# EAGLE design MD4 (EAGLE 7.4.0)
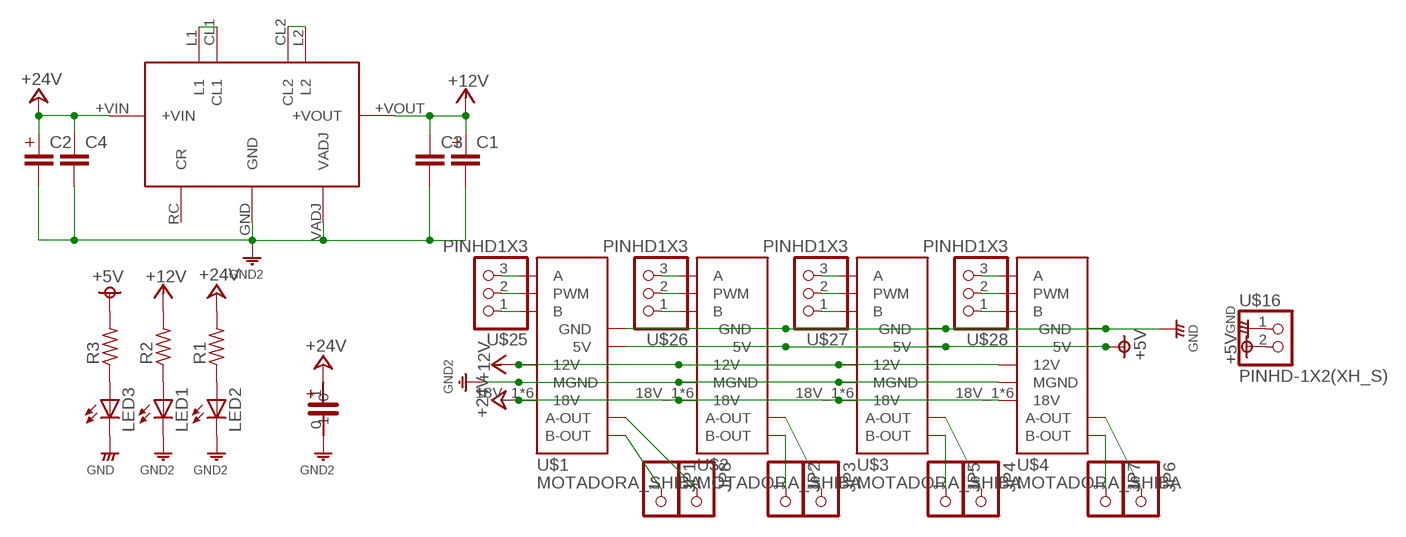
[diagram p0: schematic, sheet 1]

## Parts
C1  CAPACITOR-1U  [C_1U]
C2  CAPACITOR-1U  [C_1U]
C3  MLCC-5  [MLCC_50]
C4  MLCC-5  [MLCC_50]
CAPACITOR1  CAPACITOR  [CAPACITOR]
JP1  PINHD-1X1  [1X01]
JP2  PINHD-1X1  [1X01]
JP3  PINHD-1X1  [1X01]
JP4  PINHD-1X1  [1X01]
JP5  PINHD-1X1  [1X01]
JP6  PINHD-1X1  [1X01]
JP7  PINHD-1X1  [1X01]
JP8  PINHD-1X1  [1X01]
LED1  LED3MM  [LED3MM]
LED2  LED3MM  [LED3MM]
LED3  LED3MM  [LED3MM]
R1  RESISTORS-3  [R_0.3]
R2  RESISTORS-3  [R_0.3]
R3  RESISTORS-3  [R_0.3]
U$1  MOTADORA_SHIBA  [MOTADORA_SHIBA]
U$2  MOTADORA_SHIBA  [MOTADORA_SHIBA]
U$3  MOTADORA_SHIBA  [MOTADORA_SHIBA]
U$4  MOTADORA_SHIBA  [MOTADORA_SHIBA]
U$10  HPH12002M  [HPH12002M]
U$16  PINHD-1X2(XH_S)  [1X2(XH-S)]
U$25  PINHD1X3  [1X3(XH)]
U$26  PINHD1X3  [1X3(XH)]
U$27  PINHD1X3  [1X3(XH)]
U$28  PINHD1X3  [1X3(XH)]

## Nets
+5V: R3.2 U$1.5V U$1.5V_2(5V) U$2.5V U$2.5V_2(5V) U$3.5V U$3.5V_2(5V) U$4.5V U$4.5V_2(5V) U$16.2
+12V: C1.P$1 C3.1 R2.2 U$1.12V_1(12V) U$1.12V_2(12V) U$1.12V_3(12V) U$1.12V_4(12V) U$1.12V_5(12V) U$1.12V_6(12V) U$2.12V_1(12V) U$2.12V_2(12V) U$2.12V_3(12V) U$2.12V_4(12V) U$2.12V_5(12V) U$2.12V_6(12V) U$3.12V_1(12V) U$3.12V_2(12V) U$3.12V_3(12V) U$3.12V_4(12V) U$3.12V_5(12V) U$3.12V_6(12V) U$4.12V_1(12V) U$4.12V_2(12V) U$4.12V_3(12V) U$4.12V_4(12V) U$4.12V_5(12V) U$4.12V_6(12V) U$10.+VOUT
GND: LED3.K(C) U$1.GND U$1.GND2(GND) U$2.GND U$2.GND2(GND) U$3.GND U$3.GND2(GND) U$4.GND U$4.GND2(GND) U$16.1
GND12: C1.P$2 C2.P$2 C3.2 C4.2 CAPACITOR1.0 LED1.K(C) LED2.K(C) U$1.MGND_1(MGND) U$1.MGND_2(MGND) U$1.MGND_3(MGND) U$1.MGND_4(MGND) U$1.MGND_5(MGND) U$1.MGND_6(MGND) U$2.MGND_1(MGND) U$2.MGND_2(MGND) U$2.MGND_3(MGND) U$2.MGND_4(MGND) U$2.MGND_5(MGND) U$2.MGND_6(MGND) U$3.MGND_1(MGND) U$3.MGND_2(MGND) U$3.MGND_3(MGND) U$3.MGND_4(MGND) U$3.MGND_5(MGND) U$3.MGND_6(MGND) U$4.MGND_1(MGND) U$4.MGND_2(MGND) U$4.MGND_3(MGND) U$4.MGND_4(MGND) U$4.MGND_5(MGND) U$4.MGND_6(MGND) U$10.GND U$10.VADJ ; supply symbol labelled GND2
N$1: JP1.1 U$1.B-OUT_1(B-OUT) U$1.B-OUT_2(B-OUT) U$1.B-OUT_3(B-OUT) U$1.B-OUT_4(B-OUT) U$1.B-OUT_5(B-OUT) U$1.B-OUT_6(B-OUT)
N$3: JP3.1 U$2.A-OUT_1(A-OUT) U$2.A-OUT_2(A-OUT) U$2.A-OUT_3(A-OUT) U$2.A-OUT_4(A-OUT) U$2.A-OUT_5(A-OUT) U$2.A-OUT_6(A-OUT)
N$4: JP4.1 U$3.A-OUT_1(A-OUT) U$3.A-OUT_2(A-OUT) U$3.A-OUT_3(A-OUT) U$3.A-OUT_4(A-OUT) U$3.A-OUT_5(A-OUT) U$3.A-OUT_6(A-OUT)
N$5: JP5.1 U$3.B-OUT_1(B-OUT) U$3.B-OUT_2(B-OUT) U$3.B-OUT_3(B-OUT) U$3.B-OUT_4(B-OUT) U$3.B-OUT_5(B-OUT) U$3.B-OUT_6(B-OUT)
N$7: JP7.1 U$4.B-OUT_1(B-OUT) U$4.B-OUT_2(B-OUT) U$4.B-OUT_3(B-OUT) U$4.B-OUT_4(B-OUT) U$4.B-OUT_5(B-OUT) U$4.B-OUT_6(B-OUT)
N$8: JP8.1 U$1.A-OUT_1(A-OUT) U$1.A-OUT_2(A-OUT) U$1.A-OUT_3(A-OUT) U$1.A-OUT_4(A-OUT) U$1.A-OUT_5(A-OUT) U$1.A-OUT_6(A-OUT)
N$9: U$1.B U$1.B2(B) U$25.1
N$10: U$1.PWM U$1.PWM2(PWM) U$25.2
N$11: U$1.A U$1.A2(A) U$25.3
N$12: U$2.B U$2.B2(B) U$26.1
N$13: U$2.PWM U$2.PWM2(PWM) U$26.2
N$14: U$2.A U$2.A2(A) U$26.3
N$15: U$3.B U$3.B2(B) U$27.1
N$16: U$3.PWM U$3.PWM2(PWM) U$27.2
N$17: U$3.A U$3.A2(A) U$27.3
N$18: U$4.B U$4.B2(B) U$28.1
N$19: U$4.PWM U$4.PWM2(PWM) U$28.2
N$20: U$4.A U$4.A2(A) U$28.3
N$21: LED2.A R1.1
N$22: U$10.CL2 U$10.L2
N$23: U$10.CL1 U$10.L1
N$24: LED1.A R2.1
N$25: LED3.A R3.1
N$26: JP6.1 U$4.A-OUT_1(A-OUT) U$4.A-OUT_2(A-OUT) U$4.A-OUT_3(A-OUT) U$4.A-OUT_4(A-OUT) U$4.A-OUT_5(A-OUT) U$4.A-OUT_6(A-OUT)
N$27: JP2.1 U$2.B-OUT_1(B-OUT) U$2.B-OUT_2(B-OUT) U$2.B-OUT_3(B-OUT) U$2.B-OUT_4(B-OUT) U$2.B-OUT_5(B-OUT) U$2.B-OUT_6(B-OUT)
N$30: C2.P$1 C4.1 CAPACITOR1.1 R1.2 U$1.18V_1(18V) U$1.18V_2(18V) U$1.18V_3(18V) U$1.18V_4(18V) U$1.18V_5(18V) U$1.18V_6(18V) U$2.18V_1(18V) U$2.18V_2(18V) U$2.18V_3(18V) U$2.18V_4(18V) U$2.18V_5(18V) U$2.18V_6(18V) U$3.18V_1(18V) U$3.18V_2(18V) U$3.18V_3(18V) U$3.18V_4(18V) U$3.18V_5(18V) U$3.18V_6(18V) U$4.18V_1(18V) U$4.18V_2(18V) U$4.18V_3(18V) U$4.18V_4(18V) U$4.18V_5(18V) U$4.18V_6(18V) U$10.+VIN ; supply symbol labelled +24V
Unconnected: U$10.RC(CR)

## Library data of the parts
C1 C2 = rcl__s:CAPACITOR
C3 C4 = rcl__s:MLCC: CAPACITOR, European symbol
CAPACITOR1 = capacitor 3300:CAPACITOR: capacitor3300
JP1-JP8 = pinhead_s:PINHD-1X1: PIN HEADER
LED1-LED3 = LED_s:LED: LED OSRAM: - CHIPLED LG R971, LG N971, LY N971, LG Q971, LY Q971, LO R971, LY R971 LH N974, LH R974 LS Q976, LO Q976, LY Q976 LO Q996 - Hyper CHIPLED LW Q18S LB Q993, LB Q99A, LB R99A - SideLED LS A670, LO A670, LY A670, LG A670, LP A670 LB A673, LV A673, LT A673, LW A673 LH A674 LY A675 LS A676, LA A676, LO A676, LY A676, LW A676 LS A679, LY A679, LG A679 - Hyper Micro SIDELED® LS Y876, LA Y876, LO Y876, LY Y876 LT Y87S - SmartLED LW L88C, LW L88S LB L89C, LB L89S, LG L890 LS L89K, LO L89K, LY L89K LS L896, LA L896, LO L896, LY L896 - TOPLED LS T670, LO T670, LY T670, LG T670, LP T670 LSG T670, LSP T670, LSY T670, LOP T670, LYG T670 LG T671, LOG T671, LSG T671 LB T673, LV T673, LT T673, LW T673 LH T674 LS T676, LA T676, LO T676, LY T676, LB T676, LH T676, LSB T676, LW T676 LB T67C, LV T67C, LT T67C, LS T67K, LO T67K, LY T67K, LW E67C LS E67B, LA E67B, LO E67B, LY E67B, LB E67C, LV E67C, LT E67C LW T67C LS T679, LY T679, LG T679 LS T770, LO T770, LY T770, LG T770, LP T770 LB T773, LV T773, LT T773, LW T773 LH T774 LS E675, LA E675, LY E675, LS T675 LS T776, LA T776, LO T776, LY T776, LB T776 LHGB T686 LT T68C, LB T68C - Hyper Mini TOPLED® LB M676 - Mini TOPLED Santana® LG M470 LS M47K, LO M47K, LY M47K Source: http://www.osram.convergy.de - LUMILED® LXK2-PW12-R00, LXK2-PW12-S00, LXK2-PW14-U00, LXK2-PW14-V00 LXK2-PM12-R00, LXK2-PM12-S00, LXK2-PM14-U00 LXK2-PE12-Q00, LXK2-PE12-R00, LXK2-PE12-S00, LXK2-PE14-T00, LXK2-PE14-U00 LXK2-PB12-K00, LXK2-PB12-L00, LXK2-PB12-M00, LXK2-PB14-N00, LXK2-PB14-P00, LXK2-PB14-Q00 LXK2-PR12-L00, LXK2-PR12-M00, LXK2-PR14-Q00, LXK2-PR14-R00 LXK2-PD12-Q00, LXK2-PD12-R00, LXK2-PD12-S00 LXK2-PH12-R00, LXK2-PH12-S00 LXK2-PL12-P00, LXK2-PL12-Q00, LXK2-PL12-R00 Source: www.luxeon.com
R1-R3 = rcl__s:RESISTORS
U$1-U$4 = motadora2011:MOTADORA_SHIBA
U$10 = dc-dc_s:HPH12002M: ＤＣ－ＤＣコンバータ ５～２４Ｖ可変 http://akizukidenshi.com/catalog/g/gM-02038/
U$16 = pinhead_s:PINHD-1X2(XH_S)
U$25-U$28 = pinhead_s:PINHD1X3

## Board
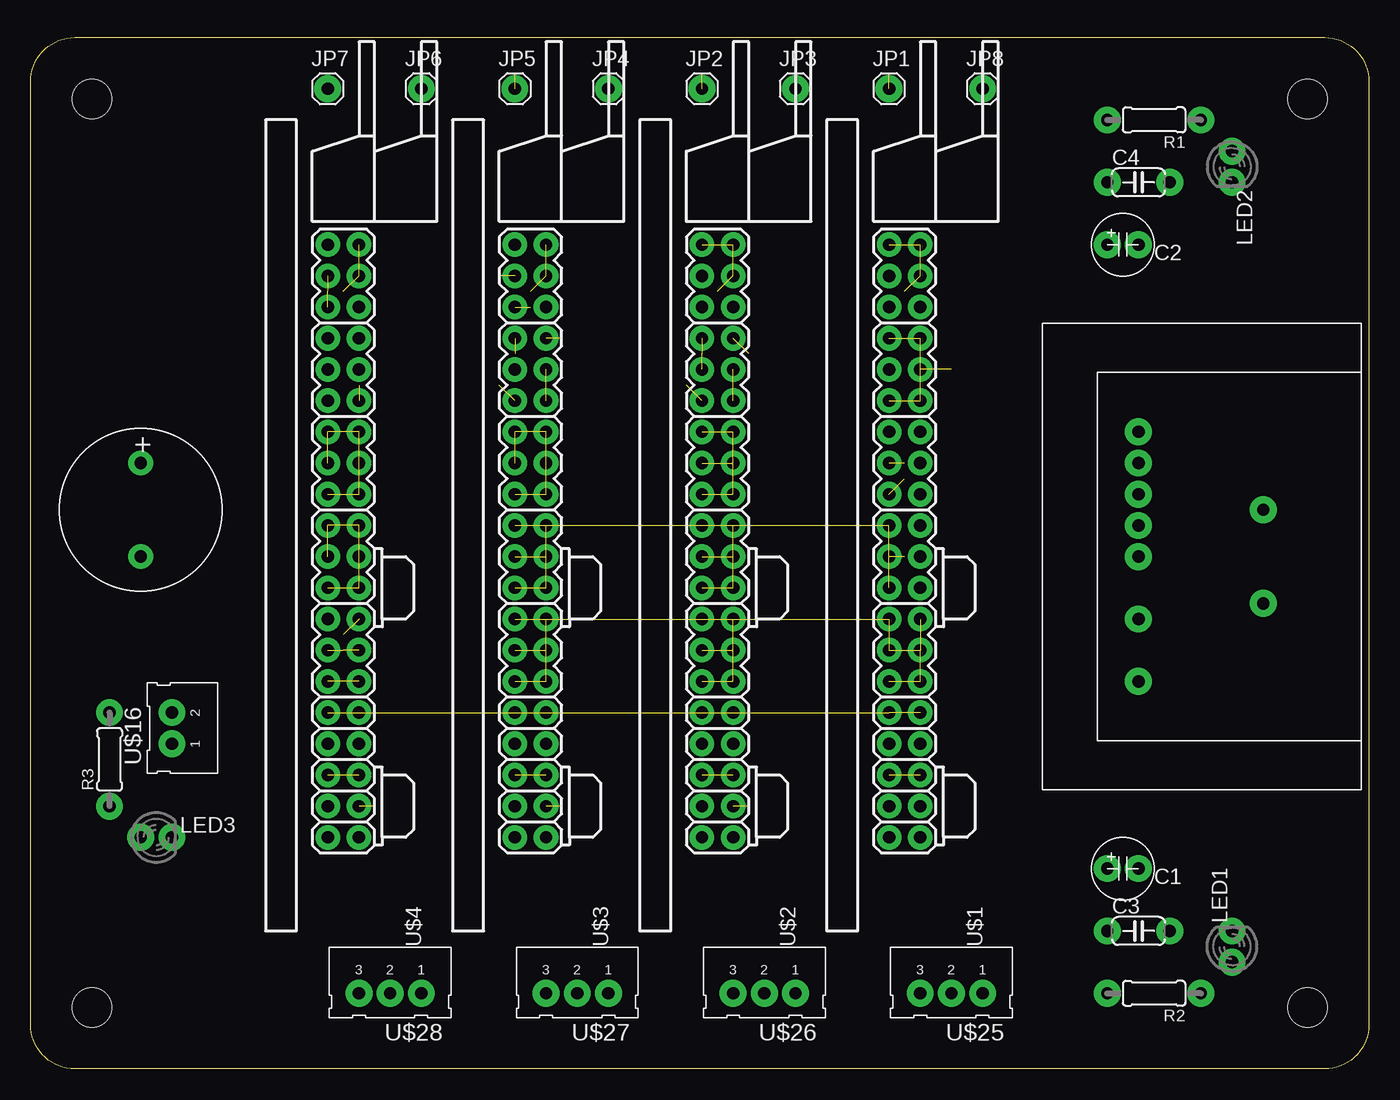
[diagram p1: board, top side]
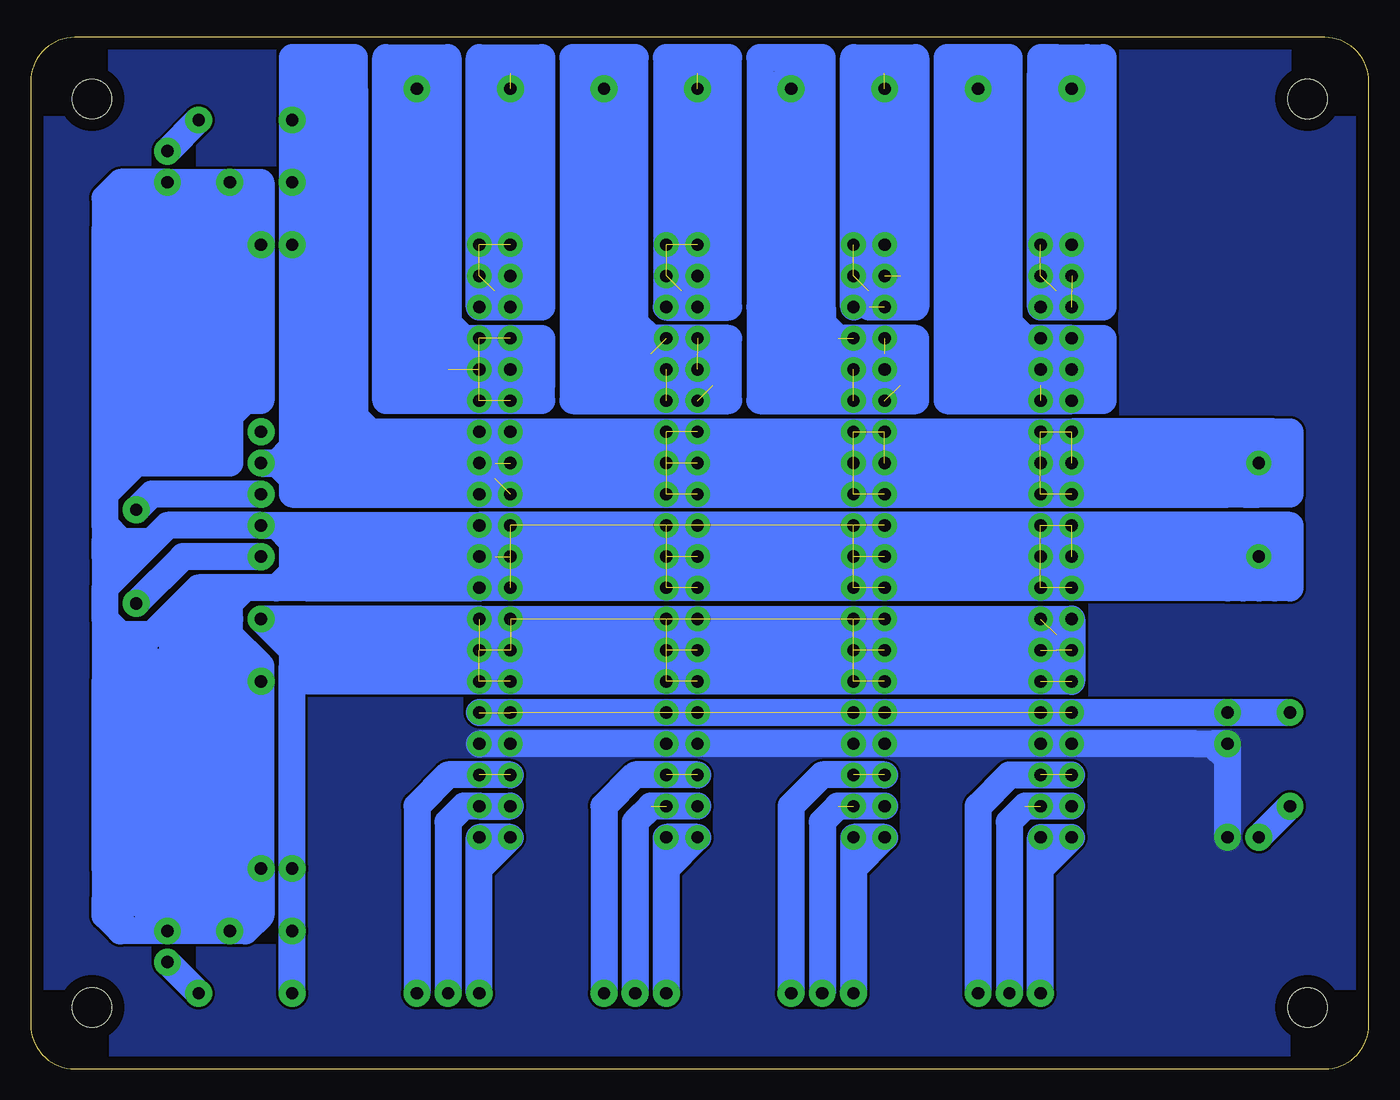
[diagram p2: board, bottom side, seen from below]

Size 109 x 84 mm. Coordinates in mm from the lower left corner, seen from the top.
Outline: 105.39,0 3.61,0 arc-90 0,3.61 0,80.39 arc-90 3.61,84 105.39,84 arc-90 109,80.39 109,3.61 arc-90 105.39,0
Copper layers (1*16): Top 0.035mm / dielectric 1.5mm / Bottom 0.035mm
Design rules "default": minimum track width 10mil, minimum drill 24mil, track to track 8mil, track to pad 8mil, pad to pad 8mil, via to via 8mil, smd to smd 8mil, copper to edge 40mil, drill to drill 8mil, minimum pad ring 10mil, minimum via ring 8mil, stop-mask expansion 4mil, vias tented up to drill 0mil, thermal gap 10mil
Holes 3.2 mm at 5,5 104,5 104,79 5,79

### Footprints (pad centres in the part's own frame; a part is rotated, then mirrored left to right if it is on the bottom)
C_1U = drill 1 pad 2.184: P$1 -1.27,0; P$2 1.27,0
MLCC_50 = drill 1 pad 2.184: 1 -2.54,0; 2 2.54,0
CAPACITOR = drill 1 pad 2: 0 -3.81,0; 1 3.81,0
1X01 = drill 1 pad 2.184: 1 0,0
LED3MM = drill 1 pad 2.184: A -1.27,0; K 1.27,0
R_0.3 = drill 1 pad 2.184: 1 -3.81,0; 2 3.81,0
MOTADORA_SHIBA = drill 1 pad 2: 5V -12.7,-1.27; 5V_2 -12.7,1.27; 12V_1 -10.16,-1.27; 12V_2 -7.62,-1.27; 12V_3 -5.08,-1.27; 12V_4 -10.16,1.27; 12V_5 -7.62,1.27; 12V_6 -5.08,1.27; 18V_1 5.08,-1.27; 18V_2 7.62,-1.27; 18V_3 10.16,-1.27; 18V_4 5.08,1.27; 18V_5 7.62,1.27; 18V_6 10.16,1.27; A -22.86,-1.27; A2 -22.86,1.27; A-OUT_1 12.7,-1.27; A-OUT_2 15.24,-1.27; A-OUT_3 17.78,-1.27; A-OUT_4 12.7,1.27; A-OUT_5 15.24,1.27; A-OUT_6 17.78,1.27; B -17.78,-1.27; B2 -17.78,1.27; B-OUT_1 20.32,-1.27; B-OUT_2 22.86,-1.27; B-OUT_3 25.4,-1.27; B-OUT_4 20.32,1.27; B-OUT_5 22.86,1.27; B-OUT_6 25.4,1.27; GND -15.24,-1.27; GND2 -15.24,1.27; MGND_1 -2.54,-1.27; MGND_2 0,-1.27; MGND_3 2.54,-1.27; MGND_4 -2.54,1.27; MGND_5 0,1.27; MGND_6 2.54,1.27; PWM -20.32,-1.27; PWM2 -20.32,1.27
HPH12002M = drill 1 pad 2.184: +VIN -7.62,-10.16; +VOUT 5.08,-10.16; CL1 0,-10.16; CL2 -5.08,-10.16; GND -2.54,-10.16; L1 3.81,0; L2 -3.81,0; RC -10.16,-10.16; VADJ 10.16,-10.16
1X2(XH-S) = drill 1 pad 2.184: 1 -6.35,0; 2 -3.81,0
1X3(XH) = drill 1 pad 2.184: 1 -2.54,0; 2 0,0; 3 2.54,0

### Placement (x,y rotation side)
C1  88.97,16.32 0 top
C2  88.97,67.12 0 top
C3  90.24,11.24 0 top
C4  90.24,72.2 0 top
CAPACITOR1  8.96,45.53 90 top
JP1  69.92,79.82 0 top
JP2  54.68,79.82 0 top
JP3  62.3,79.82 0 top
JP4  47.06,79.82 0 top
JP5  39.44,79.82 0 top
JP6  31.82,79.82 0 top
JP7  24.2,79.82 0 top
JP8  77.54,79.82 0 top
LED1  97.86,9.97 90 top
LED2  97.86,73.47 270 top
LED3  10.23,18.86 0 top
R1  91.51,77.28 180 top
R2  91.51,6.16 180 top
R3  6.42,25.21 90 top
U$1  71.19,41.72 90 top
U$2  55.95,41.72 90 top
U$3  40.71,41.72 90 top
U$4  25.47,41.72 90 top
U$10  100.4,41.72 270 top
U$16  11.5,32.83 90 top
U$25  75,6.16 180 top
U$26  59.76,6.16 180 top
U$27  44.52,6.16 180 top
U$28  29.28,6.16 180 top

### Tracks (layer width: path | path; a pad name or v marks a point on that pad's centre or on a via)
+5V  (7 unrouted)
  Bottom 2.184: U$1.5V U$16.2 R3.2
+12V  (21 unrouted)
  Bottom 2.184: R2.2 C3.1 C1.P$1 87.7,31.56 | 87.7,31.56 87.7,32.83 | 87.7,34.1 U$10.+VOUT 87.7,36.64 | 87.7,36.64 U$1.12V_3 U$4.12V_6 24.2,32.83 | 24.2,32.83 U$4.12V_4 87.7,31.56 | 87.7,36.64 87.7,35.37 | 87.7,35.37 87.7,34.1 | 87.7,35.37 25.47,35.37 25.47,34.1 87.7,34.1 | 87.7,34.1 87.7,32.83 | 87.7,32.83 24.2,32.83
GND
  Bottom 2.184: 12.77,26.48 U$16.1 11.5,25.21 | U$1.GND 14.04,26.48 12.77,26.48 | LED3.K 11.5,25.21 | 12.77,26.48 11.5,25.21
  pour Bottom: -1.2,84.9 110.56,84.9 110.56,1.08 -1.2,1.08
GND12  (20 unrouted)
  Bottom 2.184: CAPACITOR1.0 U$4.MGND_6 | U$4.MGND_6 U$1.MGND_3 | CAPACITOR1.0 11.5,39.18 | 11.5,39.18 U$1.MGND_1 | U$1.MGND_1 72.46,40.45 | 72.46,40.45 U$1.MGND_2 | 72.46,42.99 U$1.MGND_3 | CAPACITOR1.0 8.96,40.45 10.23,39.18 | 10.23,39.18 11.5,39.18 | CAPACITOR1.0 10.23,42.99 72.46,42.99 | 72.46,42.99 71.19,41.72 10.23,41.72 11.5,40.45 72.46,40.45 | U$10.GND U$1.MGND_3 | 90.24,13.78 C1.P$2 U$10.VADJ 90.24,32.83 92.78,35.37 92.78,36.64 | 90.24,13.78 C3.2 | C3.2 LED1.K | LED2.K C4.2 90.24,72.2 C2.P$2 | U$10.GND 97.86,44.26 99.13,42.99 | 100.4,41.72 101.67,41.72 | 101.67,41.72 102.94,41.72 | 102.94,41.72 102.94,42.99 | 102.94,44.26 102.94,46.8 | 102.94,48.07 102.94,67.12 | 102.94,67.12 LED2.K | 102.94,41.72 102.94,39.18 | 102.94,36.64 102.94,31.56 | 102.94,16.32 LED1.K | U$10.GND 88.97,44.26 87.7,42.99 87.7,40.45 | 87.7,40.45 86.43,39.18 | 86.43,39.18 U$1.MGND_1 | 72.46,40.45 85.16,40.45 86.43,41.72 86.43,42.99 72.46,42.99 | 72.46,42.99 U$1.MGND_2 | U$1.MGND_2 85.16,41.72 | C2.P$2 92.78,67.12 | 92.78,67.12 100.4,67.12 | 102.94,67.12 100.4,67.12 | 100.4,67.12 96.59,70.93 91.51,70.93 91.51,68.39 97.86,68.39 96.59,69.66 92.78,69.66 | LED2.K 101.67,72.2 102.94,70.93 102.94,68.39 | 102.94,67.12 102.94,68.39 | 102.94,68.39 100.4,70.93 | 86.43,39.18 88.97,39.18 | 88.97,39.18 91.51,39.18 | 91.51,39.18 92.78,39.18 | 92.78,39.18 95.32,39.18 99.13,35.37 | 102.94,31.56 99.13,35.37 | 99.13,35.37 101.67,35.37 102.94,36.64 | 102.94,36.64 102.94,39.18 | 102.94,39.18 100.4,41.72 | 99.13,42.99 100.4,41.72 | 100.4,41.72 101.67,42.99 | 101.67,42.99 102.94,44.26 | 102.94,44.26 102.94,42.99 | 102.94,42.99 101.67,41.72 | 101.67,41.72 101.67,42.99 | 101.67,42.99 99.13,42.99
  Bottom 2.184: 92.78,36.64 92.78,37.91 | 92.78,37.91 91.51,39.18 | C2.P$2 90.24,54.42 91.51,54.42 92.78,53.15 92.78,49.34 100.4,49.34 102.94,46.8 | 102.94,46.8 102.94,48.07 | 102.94,48.07 100.4,50.61 94.05,50.61 94.05,65.85 92.78,67.12 | 92.78,67.12 91.51,65.85 91.51,55.69 95.32,51.88 101.67,51.88 | 101.67,51.88 101.67,50.61 | 101.67,51.88 101.67,65.85 92.78,65.85 92.78,55.69 95.32,53.15 100.4,53.15 100.4,64.58 95.32,64.58 95.32,54.42 99.13,54.42 99.13,63.31 97.86,63.31 | 97.86,63.31 96.59,63.31 96.59,55.69 97.86,55.69 97.86,63.31 | 102.94,16.32 102.94,31.56 | 92.78,39.18 92.78,37.91 | 92.78,36.64 95.32,36.64 94.05,37.91 95.32,37.91 | LED1.K 101.67,11.24 102.94,12.51 102.94,13.78 | 102.94,16.32 102.94,13.78 | 102.94,13.78 101.67,12.51 | 90.24,13.78 90.24,12.51 91.51,11.24 C3.2 | 87.7,40.45 88.97,39.18 | CAPACITOR1.0 6.42,44.26 | 6.42,44.26 6.42,39.18 7.69,39.18 | 7.69,39.18 8.96,39.18 | 8.96,39.18 7.69,40.45 | 7.69,40.45 7.69,42.99 | 7.69,40.45 7.69,39.18 | 8.96,39.18 10.23,39.18 | 6.42,44.26 8.96,44.26 | 8.96,44.26 U$4.MGND_6 | 8.96,44.26 CAPACITOR1.0
N$1  (4 unrouted)
  Bottom 2.184: JP1.1 U$1.B-OUT_5 | U$1.B-OUT_1 72.46,82.36 67.38,82.36 67.38,62.04 U$1.B-OUT_4 | U$1.B-OUT_4 U$1.B-OUT_1 | U$1.B-OUT_1 71.19,63.31 | 71.19,79.82 71.19,81.09 69.92,81.09 | 69.92,81.09 68.65,81.09 68.65,63.31 71.19,63.31 | 71.19,63.31 71.19,79.82 | 71.19,79.82 69.92,81.09 | 69.92,81.09 U$1.B-OUT_4
N$2
  Bottom 6.452: 100.4,31.56 100.4,18.86 95.32,13.78 92.78,16.32 92.78,31.56 95.32,34.1 95.32,18.86
N$3  (5 unrouted)
  Bottom 2.184: JP3.1 62.3,62.04 58.49,58.23 | 58.49,58.23 U$2.A-OUT_2 | 54.68,58.23 58.49,58.23 | 58.49,58.23 61.03,58.23 61.03,81.09 63.57,81.09 63.57,55.69 53.41,55.69 53.41,56.96 62.3,56.96 62.3,60.77
N$4  (4 unrouted)
  Bottom 2.184: JP4.1 47.06,62.04 45.79,60.77 | 45.79,60.77 44.52,59.5 | 44.52,59.5 U$3.A-OUT_2 | 36.9,59.5 38.17,59.5 | 38.17,59.5 43.25,59.5 | 43.25,59.5 44.52,59.5 | 44.52,59.5 44.52,60.77 | 49.6,62.04 49.6,82.36 44.52,82.36 44.52,62.04 44.52,60.77 | 49.6,62.04 49.6,54.42 36.9,54.42 36.9,59.5 | 36.9,59.5 U$3.A-OUT_5 | 38.17,59.5 38.17,55.69 48.33,55.69 48.33,60.77 44.52,56.96 U$3.A-OUT_5 | U$3.A-OUT_5 39.44,58.23 45.79,58.23 47.06,56.96 | 49.6,62.04 48.33,62.04 48.33,79.82 47.06,81.09 45.79,81.09 45.79,60.77 | 44.52,60.77 43.25,59.5
N$5  (5 unrouted)
  Bottom 2.184: JP5.1 U$3.B-OUT_6 | 40.71,62.04 36.9,62.04 36.9,82.36 41.98,82.36 U$3.B-OUT_1 40.71,63.31 40.71,81.09 39.44,81.09 | 39.44,81.09 38.17,81.09 38.17,64.58 39.44,63.31 | 38.17,63.31 39.44,63.31 | 39.44,63.31 39.44,81.09
N$7  (4 unrouted)
  Bottom 2.184: JP7.1 U$4.B-OUT_6 24.2,63.31 22.93,63.31 22.93,79.82 24.2,81.09 25.47,79.82 25.47,63.31 U$4.B-OUT_1 | U$4.B-OUT_1 26.74,81.09 | 26.74,81.09 25.47,82.36 | 25.47,82.36 22.93,82.36 | 22.93,82.36 21.66,81.09 | 21.66,81.09 21.66,79.82 21.66,62.04 U$4.B-OUT_1 | 25.47,82.36 26.74,82.36 26.74,81.09 | 22.93,82.36 21.66,82.36 21.66,81.09
N$8  (5 unrouted)
  Bottom 2.184: JP8.1 77.54,59.5 75,56.96 U$1.A-OUT_5
N$9  (1 unrouted)
  Bottom 2.184: U$1.B2 75,23.94 77.54,21.4 U$25.1
N$10
  Bottom 2.184: U$1.PWM2 U$1.PWM 73.73,21.4 75,20.13 U$25.2
N$11
  Bottom 2.184: U$25.3 72.46,16.32 | 72.46,16.32 U$1.A U$1.A2 72.46,16.32
N$12  (1 unrouted)
  Bottom 2.184: U$2.B2 59.76,23.94 62.3,21.4 U$26.1
N$13  (1 unrouted)
  Bottom 2.184: U$2.PWM2 58.49,21.4 59.76,20.13 U$26.2
N$14
  Bottom 2.184: U$26.3 57.22,16.32 | 57.22,16.32 U$2.A U$2.A2 57.22,16.32
N$15  (1 unrouted)
  Bottom 2.184: U$3.B2 44.52,23.94 47.06,21.4 U$27.1
N$16  (1 unrouted)
  Bottom 2.184: U$3.PWM2 43.25,21.4 44.52,20.13 U$27.2
N$17
  Bottom 2.184: 41.98,16.32 U$3.A U$3.A2 41.98,16.32 | 41.98,16.32 U$27.3
N$18  (1 unrouted)
  Bottom 2.184: U$4.B2 29.28,23.94 31.82,21.4 U$28.1
N$19  (1 unrouted)
  Bottom 2.184: U$4.PWM2 28.01,21.4 29.28,20.13 U$28.2
N$20
  Bottom 2.184: U$28.3 26.74,16.32 | 26.74,16.32 U$4.A U$4.A2 26.74,16.32
N$21
  Bottom 2.184: R1.1 LED2.A
N$22
  Bottom 2.184: U$10.CL2 99.13,46.8 U$10.L2
N$23
  Bottom 2.184: U$10.CL1 96.59,41.72 U$10.L1
N$24
  Bottom 2.184: LED1.A R2.1
N$25
  Bottom 2.184: LED3.A R3.1
N$26  (1 unrouted)
  Bottom 2.184: 29.28,82.36 31.82,82.36 | 31.82,82.36 34.36,82.36 34.36,54.42 28.01,54.42 | 31.82,62.04 JP6.1 31.82,82.36 | 31.82,62.04 30.55,60.77 | 30.55,60.77 29.28,59.5 | 28.01,54.42 U$4.A-OUT_4 | U$4.A-OUT_4 U$4.A-OUT_5 | U$4.A-OUT_5 U$4.A-OUT_6 | U$4.A-OUT_6 U$4.A-OUT_3 | U$4.A-OUT_3 28.01,59.5 | 28.01,59.5 29.28,59.5 | 29.28,59.5 29.28,82.36 | 29.28,82.36 30.55,81.09 30.55,60.77 | 30.55,60.77 29.28,60.77 28.01,59.5 | U$4.A-OUT_6 25.47,58.23 25.47,55.69 26.74,55.69 | U$4.A-OUT_3 U$4.A-OUT_2 | U$4.A-OUT_2 26.74,55.69 | 26.74,55.69 28.01,54.42 | 28.01,54.42 28.01,55.69 33.09,55.69 33.09,81.09 31.82,82.36 | 31.82,62.04 31.82,59.5 | 31.82,59.5 31.82,56.96 29.28,56.96 | 29.28,56.96 U$4.A-OUT_2 | U$4.A-OUT_2 29.28,59.5 | 31.82,59.5 29.28,56.96 | U$4.A-OUT_6 21.66,59.5 | 21.66,59.5 21.66,56.96 | 21.66,56.96 21.66,54.42 U$4.A-OUT_4 | 21.66,59.5 U$4.A-OUT_5 | U$4.A-OUT_5 21.66,56.96 | 21.66,56.96 U$4.A-OUT_4
N$27  (4 unrouted)
  Bottom 2.184: 52.14,82.36 57.22,82.36 U$2.B-OUT_1 U$2.B-OUT_4 | JP2.1 U$2.B-OUT_5 | U$2.B-OUT_4 52.14,62.04 52.14,82.36 | 52.14,82.36 53.41,81.09 53.41,63.31 55.95,63.31 55.95,81.09 54.68,81.09 U$2.B-OUT_4
N$28
  Bottom 2.184: 52.14,59.5 58.49,59.5 59.76,60.77 59.76,82.36 64.84,82.36 64.84,54.42 52.14,54.42 52.14,59.5 | 52.14,59.5 53.41,58.23
N$29
  Bottom 2.184: 67.38,55.69 67.38,59.5 73.73,59.5 75,60.77 75,82.36 80.08,82.36 80.08,54.42 67.38,54.42 67.38,55.69 | 67.38,55.69 78.81,55.69 78.81,58.23 | 78.81,58.23 78.81,81.09 76.27,81.09 76.27,60.77 73.73,58.23 68.65,58.23 68.65,56.96 77.54,56.96 78.81,58.23
N$30  (17 unrouted)
  Bottom 2.184: 82.62,79.82 82.62,82.36 87.7,82.36 R1.2 | R1.2 C4.1 C2.P$1 87.7,50.61 | 87.7,50.61 87.7,49.34 | 87.7,49.34 U$10.+VIN 88.97,49.34 | U$1.18V_3 U$1.18V_6 U$2.18V_3 U$3.18V_6 U$4.18V_6 | U$4.18V_6 CAPACITOR1.1 | 72.46,50.61 U$1.18V_2 | U$1.18V_2 72.46,48.07 | U$1.18V_1 11.5,46.8 | 11.5,46.8 CAPACITOR1.1 | 8.96,50.61 CAPACITOR1.1 | CAPACITOR1.1 10.23,50.61 | 11.5,49.34 10.23,50.61 | 10.23,50.61 71.19,50.61 71.19,49.34 11.5,49.34 | 10.23,49.34 11.5,49.34 | 11.5,49.34 12.77,48.07 71.19,48.07 | 8.96,50.61 10.23,46.8 | 10.23,46.8 11.5,46.8 | 87.7,49.34 U$1.18V_2 | 88.97,49.34 86.43,46.8 | 86.43,46.8 U$1.18V_1 | U$1.18V_1 72.46,48.07 | 72.46,48.07 86.43,48.07 | 88.97,49.34 87.7,50.61 | 87.7,50.61 86.43,51.88 81.35,51.88 | 81.35,51.88 U$1.18V_3 | U$1.18V_3 72.46,50.61 | 72.46,50.61 86.43,50.61 | R1.2 83.89,79.82 82.62,78.55 | 82.62,78.55 82.62,53.15 | 81.35,51.88 82.62,53.15 | 82.62,53.15 83.89,53.15 83.89,77.28 85.16,78.55 86.43,78.55 | 86.43,78.55 86.43,53.15 85.16,53.15 85.16,77.28 86.43,78.55 | R1.2 86.43,81.09 83.89,81.09 82.62,79.82 | 82.62,79.82 82.62,78.55 | 87.7,49.34 87.7,46.8 86.43,46.8 | CAPACITOR1.1 7.69,51.88 | 7.69,51.88 6.42,51.88 6.42,46.8 8.96,46.8 | 8.96,46.8 CAPACITOR1.1 | CAPACITOR1.1 7.69,48.07 7.69,49.34 | 7.69,49.34 7.69,51.88 | 10.23,46.8 8.96,46.8 | 7.69,51.88 U$4.18V_6 | 8.96,50.61 7.69,49.34